# EAGLE design TPSPowerSupply (EAGLE 8.7.0)
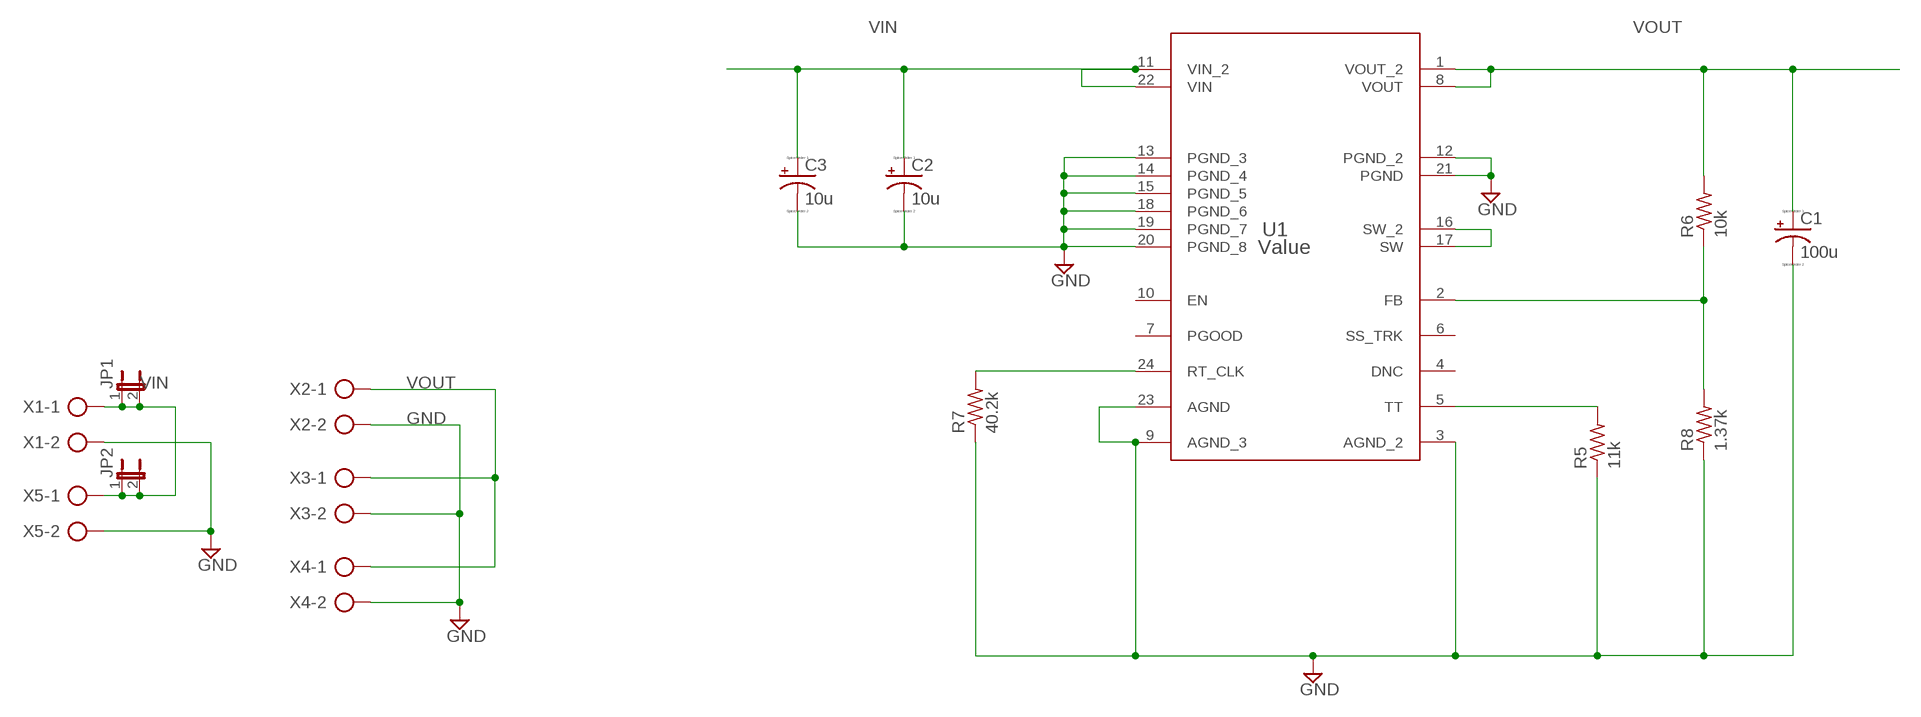
[diagram p0: schematic, sheet 1]

## Parts
C1  100u  CPOL-USTT5D11L  [TT5D11L]
C2  10u  CPOL-USTT5D11L  [TT5D11L]
C3  10u  CPOL-USTT5D11L  [TT5D11L]
JP1  JP1E  [JP1]
JP2  JP1E  [JP1]
R5  11k  R-US_0411/15  [0411/15]
R6  10k  R-US_0411/15  [0411/15]
R7  40.2k  R-US_0411/15  [0411/15]
R8  1.37k  R-US_0411/15  [0411/15]
U1  Value  TPSM84824MOLR  [MOL0024A]
X1  AK500/2  [AK500/2]
X2  AK500/2  [AK500/2]
X3  AK500/2  [AK500/2]
X4  AK500/2  [AK500/2]
X5  AK500/2  [AK500/2]

## Nets
GND: C1.- C2.- C3.- R5.1 R7.1 R8.1 U1.3(AGND_2) U1.9(AGND_3) U1.12(PGND_2) U1.13(PGND_3) U1.14(PGND_4) U1.15(PGND_5) U1.18(PGND_6) U1.19(PGND_7) U1.20(PGND_8) U1.21(PGND) U1.23(AGND) X1.2 X2.2 X3.2 X4.2 X5.2
N$2: R6.1 R8.2 U1.2(FB)
N$3: R7.2 U1.24(RT_CLK)
N$4: R5.2 U1.5(TT)
N$8: U1.16(SW_2) U1.17(SW)
VIN: C2.+ C3.+ JP1.1 JP1.2 JP2.1 JP2.2 U1.11(VIN_2) U1.22(VIN) X1.1 X5.1
VOUT: C1.+ R6.2 U1.1(VOUT_2) U1.8(VOUT) X2.1 X3.1 X4.1
Unconnected: U1.4(DNC) U1.6(SS_TRK) U1.7(PGOOD) U1.10(EN)

## Library data of the parts
C1-C3 = resistor:CPOL-US: POLARIZED CAPACITOR, American symbol
JP1 JP2 = jumper:JP1E: JUMPER
R5-R8 = resistor:R-US_: RESISTOR, American symbol
U1 = AcceleratedDesigns_Lib:TPSM84824MOLR; MANUFACTURER: Texas Instruments; MANUFACTURER_NAME: Texas Instruments; MANUFACTURER_PART_NUMBER: TPSM84824MOLR; PARTNUMBER: TPSM84824MOLR; REFDES: RefDes; TYPE: TYPE
X1-X5 = con-ptr500:AK500/2: CONNECTOR; OC_FARNELL: unknown; OC_NEWARK: unknown

## Board
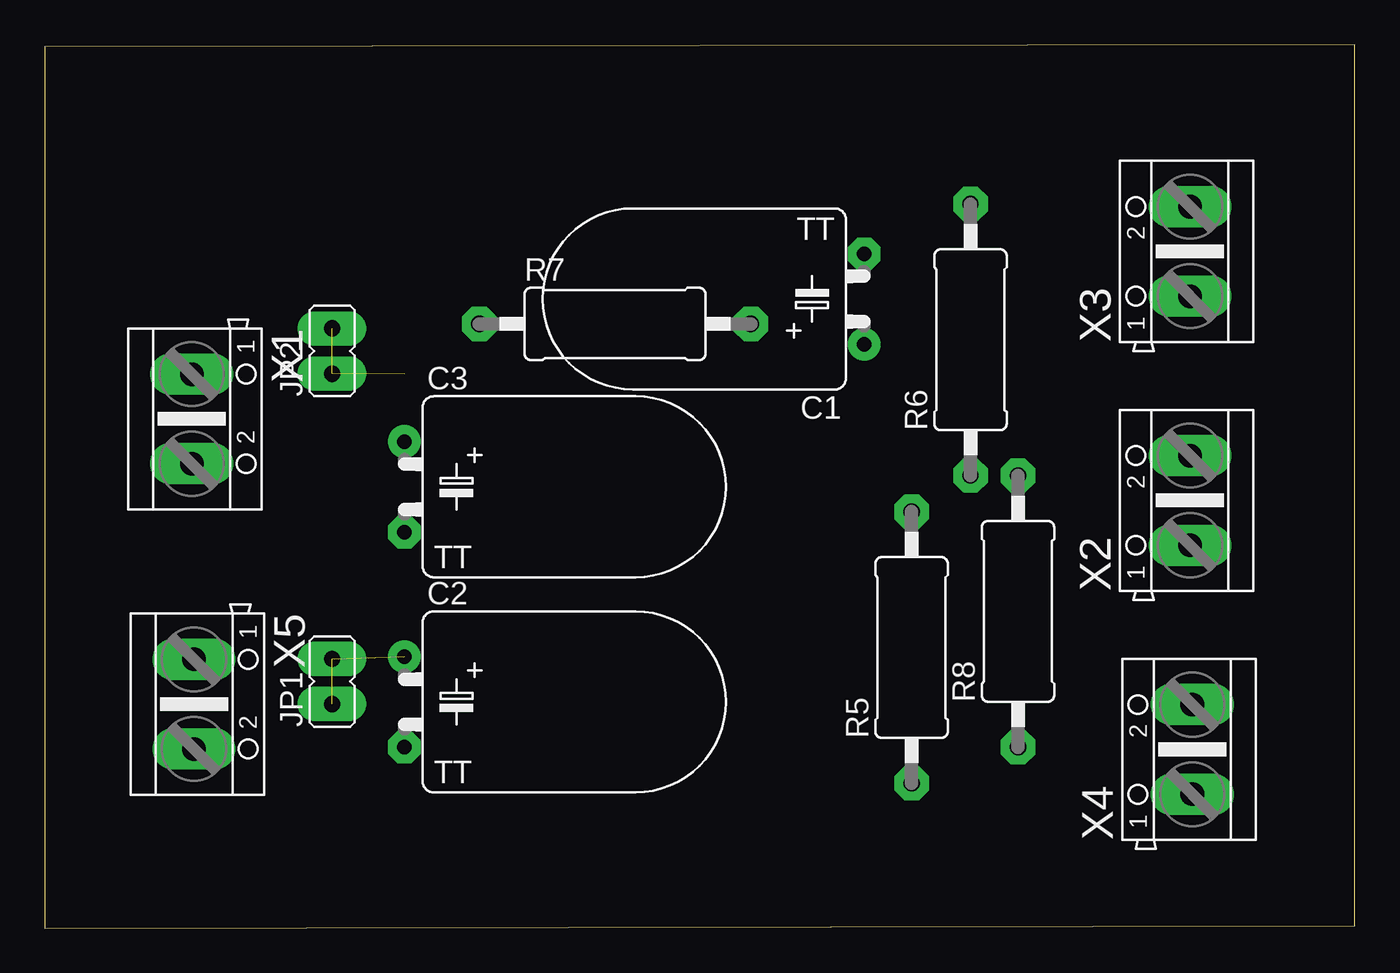
[diagram p1: board, top side]
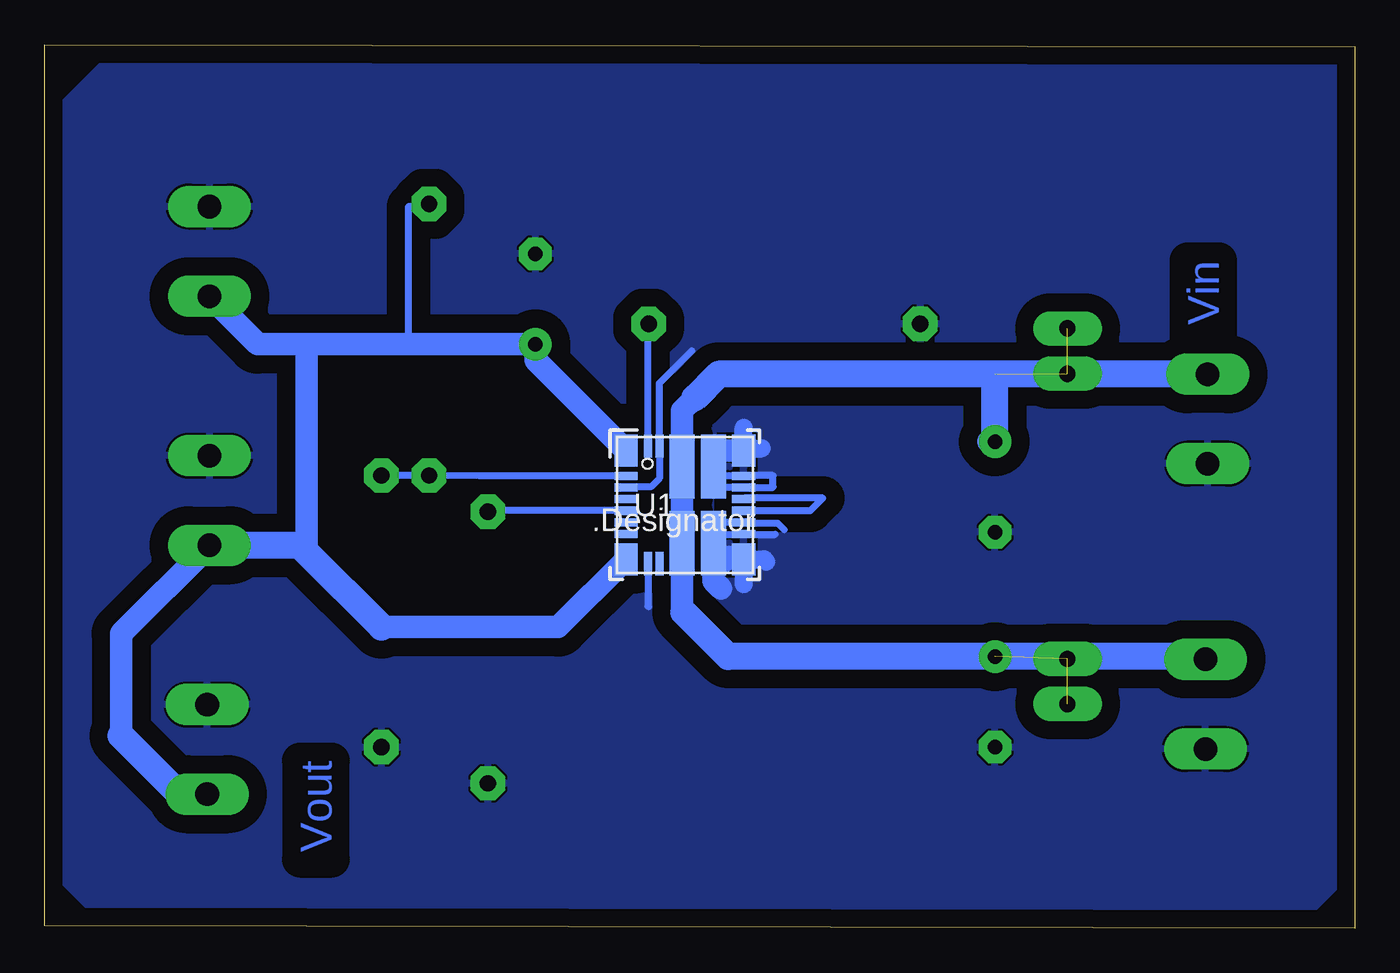
[diagram p2: board, bottom side, seen from below]

Size 73.51 x 49.58 mm. Coordinates in mm from the lower left corner, seen from the top.
Outline: 0,0 73.51,0.13 73.51,49.58 0,49.45 0,0
Copper layers (1*16): Top 0.035mm / dielectric 1.5mm / Bottom 0.035mm
Design rules "default *": minimum track width 6mil, minimum drill 0.35mm, track to track 40mil, track to pad 40mil, pad to pad 40mil, via to via 40mil, smd to smd 6mil, copper to edge 40mil, drill to drill 20mil, minimum pad ring 20mil, minimum via ring 8mil, stop-mask expansion 12mil, vias tented up to drill 0mil, thermal gap 5mil

### Footprints (pad centres in the part's own frame; a part is rotated, then mirrored left to right if it is on the bottom)
TT5D11L = drill 0.813 pad 1.6: + -2.54,0 | drill 0.813 pad 1.6 octagon: - 2.54,0
JP1 = drill 0.914 long: 1 0,-1.27; 2 0,1.27
0411/15 = drill 0.914 octagon: 1 -7.62,0; 2 7.62,0
MOL0024A = smd 1.3 x 1.8: 1 -3.3,3.05; 8 -3.3,-3.05; 13 3.3,-3.05; 20 3.3,3.05 | smd 1.3 x 0.45: 2 -3.3,1.625; 3 -3.3,0.975; 4 -3.3,0.325; 5 -3.3,-0.325; 6 -3.3,-0.975; 7 -3.3,-1.625; 14 3.3,-1.625; 15 3.3,-0.975; 16 3.3,-0.325; 17 3.3,0.325; 18 3.3,0.975; 19 3.3,1.625 | smd 0.45 x 1.3: 9 -2.075,-3.3; 10 -1.425,-3.3; 23 -1.425,3.3; 24 -2.075,3.3 | smd 1.4 x 3.6: 11 -0.15,-2.15; 12 1.6,-2.15; 21 1.6,2.15; 22 -0.15,2.15
AK500/2 = drill 1.321 long: 1 -2.515,0; 2 2.515,0

### Placement (x,y rotation side)
C1  45.97,35.31 90 top
C2  20.19,12.7 270 top
C3  20.19,24.77 270 top
JP1  16.13,13.84 0 top
JP2  16.13,32.38 0 top
R5  48.64,15.75 90 top
R6  51.94,33.02 90 top
R7  32,33.91 0 top
R8  54.61,17.78 90 top
U1  37.59,23.75 0 bottom
X1  8.25,28.58 270 top
X2  64.26,24 90 top
X3  64.26,37.97 90 top
X4  64.39,10.03 90 top
X5  8.38,12.57 270 top

### Tracks (layer width: path | path; a pad name or v marks a point on that pad's centre or on a via)
GND
  Bottom 0.406: U1.14 34.27,22.1 | 34.27,22.1 32.51,22.1 | 32,22.35 32.39,22.73 34.25,22.73 U1.15 36.03,22.77 36.07,22.73 36.07,22.86 35.31,22.1 34.27,22.1 | 37.21,32.38 39.02,30.58 U1.23 39.02,25.25 39.5,24.77 40.85,24.77 U1.3 | U1.9 39.67,18.08 39.62,18.03 | U1.21 35.47,25.37 U1.19 34.27,25.4 32.64,25.4 32.64,24.77 32.68,24.72 U1.18 36.03,24.72 36.07,24.77
  Bottom 1.016: 33.02,20.57 33.14,20.7 U1.13 34.29,19.3 | 34.29,28.07 U1.20 34.17,26.92 33.27,26.92
  Bottom 1.27: U1.12 35.99,19.48 35.56,19.05 | U1.13 34.42,20.83 35.39,20.83 35.39,20.57 | U1.20 35.39,26.8
  pour Bottom: 0.51,48.77 69.98,48.77 72.9,45.85 72.9,3.05 70.23,0.38 3.05,0.38 0.38,3.05 0.38,49.02 0.51,48.89
N$2
  Bottom 0.406: U1.2 49.12,25.37 R8.2 R6.1
N$3
  Bottom 0.406: U1.24 39.67,33.87 R7.2
N$4
  Bottom 0.406: U1.5 48.58,23.42 R5.2
N$8
  Bottom 0.406: U1.17 34.24,24.13 29.85,24.13 30.55,23.42 U1.16
VIN  (4 unrouted)
  Bottom 1.27: C3.+ 20.57,27.3 | 37.04,29.76 37.74,29.05 U1.22 U1.11 37.74,17.82 37.64,17.72
  Bottom 1.524: X1.1 20.19,31.09 | 20.19,31.09 35.7,31.09 37.04,29.76 | C3.+ 20.19,31.09 | X5.1 8.53,15.24 C2.+ 35.16,15.24 37.64,17.72
VOUT
  Bottom 0.406: 53.09,32.77 53.09,40.51 R6.2
  Bottom 1.27: U1.1 45.97,31.88 C1.+ 53.09,32.77 58.8,32.77 | 58.8,32.77 61.57,32.77 X3.1 | 65.68,21.49 X2.1 69.22,16.54 69.22,10.79 | 65.94,7.52 X4.1 | U1.8 44.7,16.89 54.61,16.89 | 58.8,21.08 58.8,32.77
  Bottom 1.524: 69.22,10.79 65.94,7.52 | 54.61,16.89 58.8,21.08 59.21,21.49 X2.1

### Text on the board
Bottom: Vin | Vout